# EAGLE design lightplay2a (EAGLE 7.2.0)
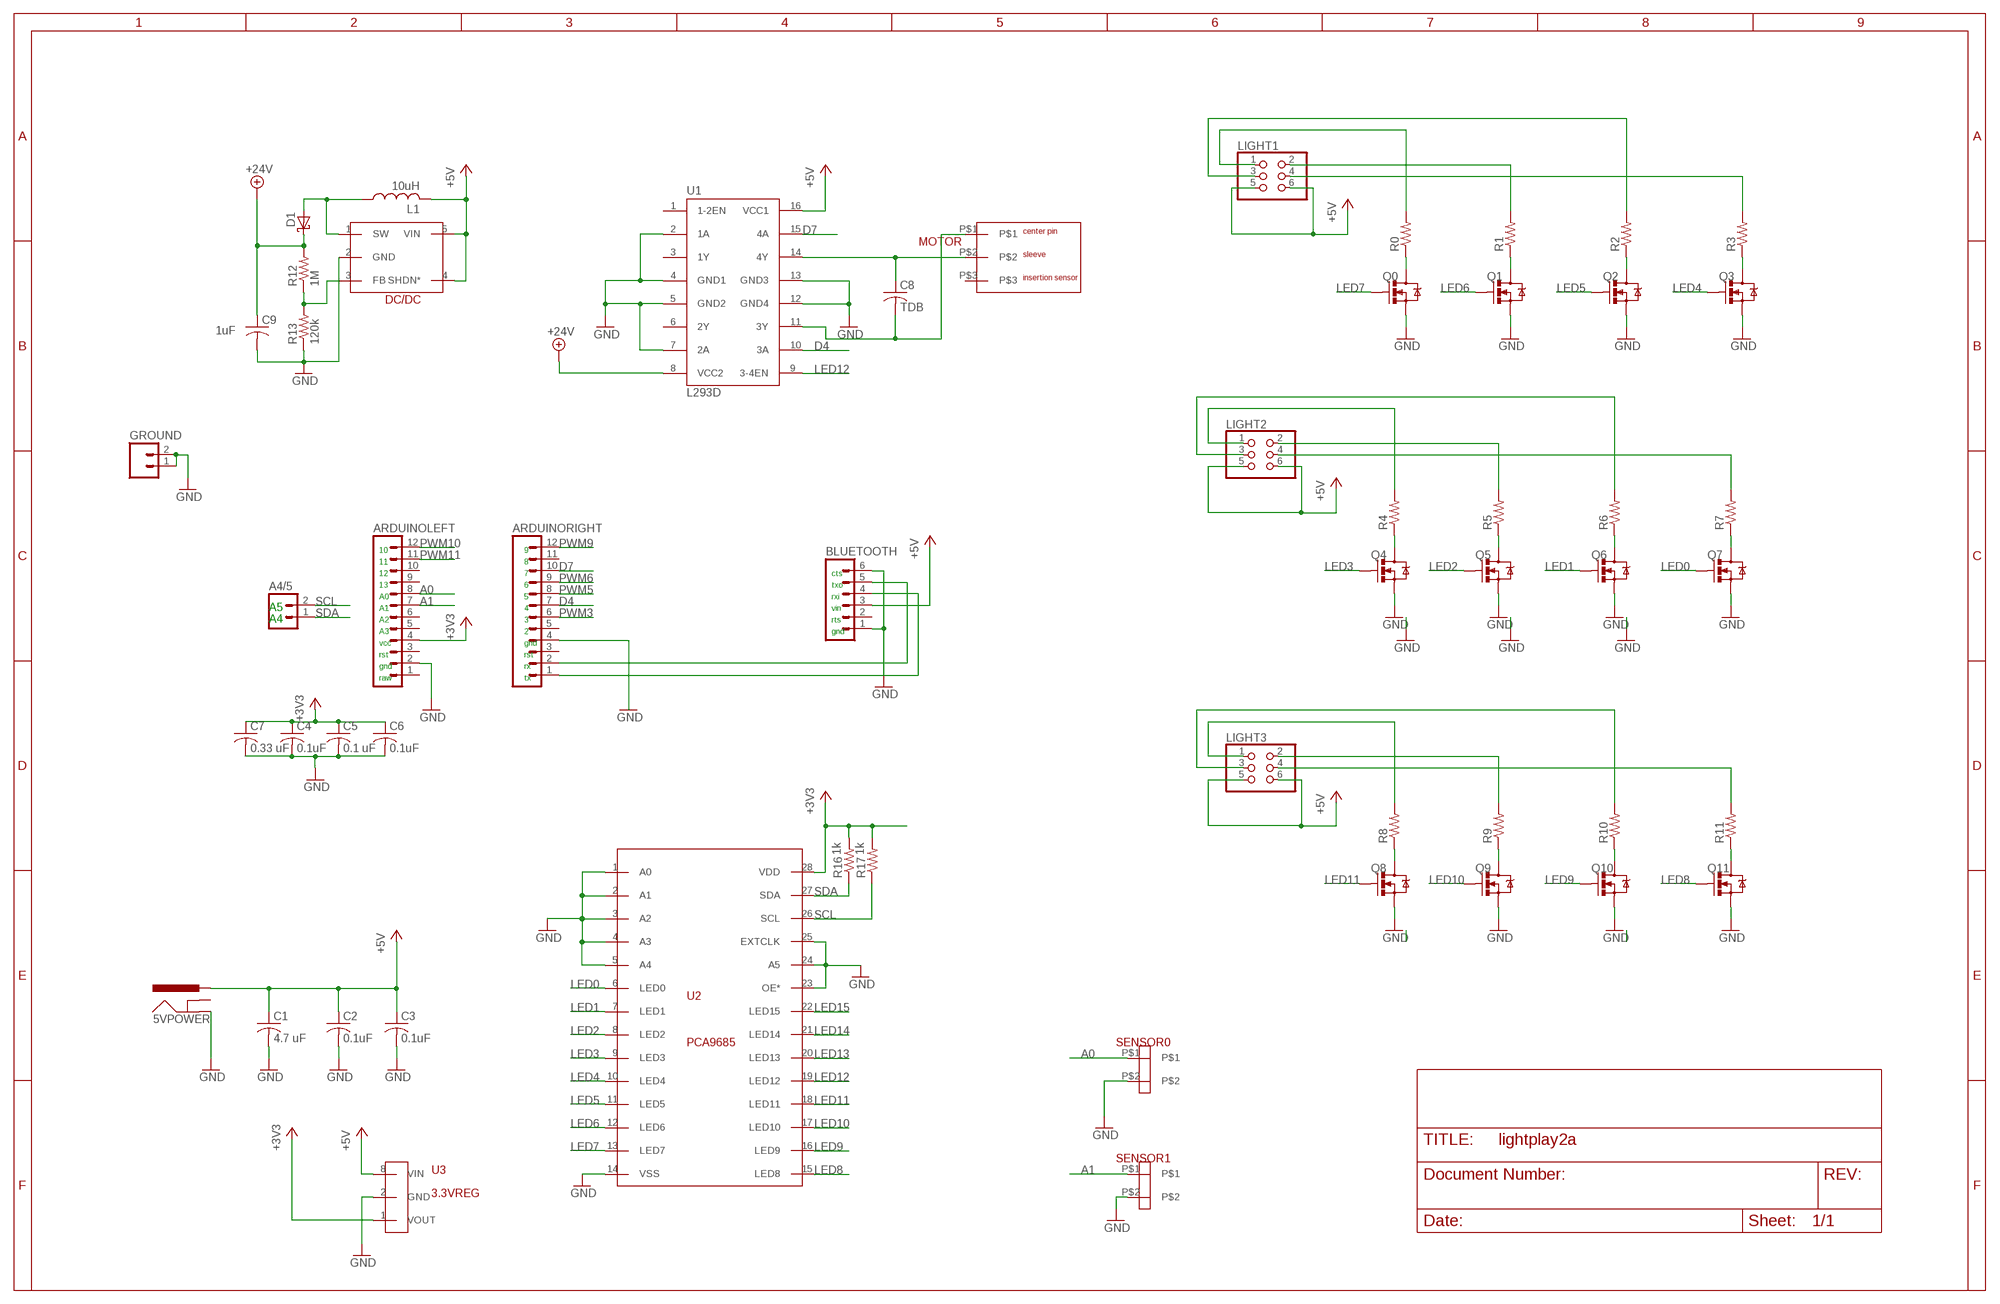
[diagram p0: schematic, sheet 1]

## Parts
5VPOWER  POWER_JACKPTH  [POWER_JACK_PTH]
A4/5  M02PTH  [1X02]
ARDUINOLEFT  M12PTH  [1X12]
ARDUINORIGHT  M12PTH  [1X12]
BLUETOOTH  M06SILK_FEMALE_PTH  [1X06]
C1  4.7 uF  C-USC1206  [C1206]
C2  0.1uF  C-USC0805  [C0805]
C3  0.1uF  C-USC0805  [C0805]
C4  0.1uF  C-USC0805  [C0805]
C5  0.1 uF  C-USC0805  [C0805]
C6  0.1uF  C-USC0805  [C0805]
C7  0.33 uF  C-USC1206  [C1206]
C8  TDB  C-USC0805  [C0805]
C9  1uF  C-USC1206  [C1206]
D1  B120_SHOTTKY_DIODE  [DO214AC]
DC/DC  LT1615  [SOT23-5]
GROUND  M02PTH  [1X02]
L1  10uH  INDUCTOR_WURTH  [INDUCTOR_WURTH]
LIGHT1  PINHD-2X3  [2X03]
LIGHT2  PINHD-2X3  [2X03]
LIGHT3  PINHD-2X3  [2X03]
MOTOR  PJ-075DH-SMT-TR  [PJ-075DH-SMT-TR]
Q0  MOSFET-NCHANNELAO3404A  [SOT23-3]
Q1  MOSFET-NCHANNELAO3404A  [SOT23-3]
Q2  MOSFET-NCHANNELAO3404A  [SOT23-3]
Q3  MOSFET-NCHANNELAO3404A  [SOT23-3]
Q4  MOSFET-NCHANNELAO3404A  [SOT23-3]
Q5  MOSFET-NCHANNELAO3404A  [SOT23-3]
Q6  MOSFET-NCHANNELAO3404A  [SOT23-3]
Q7  MOSFET-NCHANNELAO3404A  [SOT23-3]
Q8  MOSFET-NCHANNELAO3404A  [SOT23-3]
Q9  MOSFET-NCHANNELAO3404A  [SOT23-3]
Q10  MOSFET-NCHANNELAO3404A  [SOT23-3]
Q11  MOSFET-NCHANNELAO3404A  [SOT23-3]
R0  R-US_0617/17  [0617/17]
R1  R-US_0617/17  [0617/17]
R2  R-US_0617/17  [0617/17]
R3  R-US_0617/17  [0617/17]
R4  R-US_0617/17  [0617/17]
R5  R-US_0617/17  [0617/17]
R6  R-US_0617/17  [0617/17]
R7  R-US_0617/17  [0617/17]
R8  R-US_0617/17  [0617/17]
R9  R-US_0617/17  [0617/17]
R10  R-US_0617/17  [0617/17]
R11  R-US_0617/17  [0617/17]
R12  1M  R-US_R0805  [R0805]
R13  120k  R-US_R0805  [R0805]
R16  1k  R-US_R0805  [R0805]
R17  1k  R-US_R0805  [R0805]
SENSOR0  3.5MM_2PIN_SCREWTERMINAL_SPARKFUN  [1X02_3.5_SCREWTERM]
SENSOR1  3.5MM_2PIN_SCREWTERMINAL_SPARKFUN  [1X02_3.5_SCREWTERM]
U1  L293D  [DIL16]
U2  PCA9685  [TSSOP28]
U3  3.3VREG  STM3.3VREG  [SO08]

## Nets
+3V3: ARDUINOLEFT.4 C4.1 C5.1 C6.1 C7.1 R16.2 R17.2 U2.28(VDD) U3.1(VOUT)
+5V [power]: 5VPOWER.PWR BLUETOOTH.3 C1.1 C2.1 C3.1 DC/DC.4(SHDN*) DC/DC.5(VIN) L1.P$2 LIGHT1.5 LIGHT1.6 LIGHT2.5 LIGHT2.6 LIGHT3.5 LIGHT3.6 U1.16(VCC1) U3.8(VIN)
+24V [power]: C9.1 D1.C R12.2 U1.8(VCC2)
A0: ARDUINOLEFT.8 SENSOR0.P$1
A1: ARDUINOLEFT.7 SENSOR1.P$1
D4: ARDUINORIGHT.7 U1.10(3A)
D7: ARDUINORIGHT.10 U1.15(4A)
GND [power]: 5VPOWER.GND ARDUINOLEFT.2 ARDUINORIGHT.4 BLUETOOTH.1 BLUETOOTH.6 C1.2 C2.2 C3.2 C4.2 C5.2 C6.2 C7.2 C9.2 DC/DC.2(GND) GROUND.1 GROUND.2 Q0.2(S) Q1.2(S) Q2.2(S) Q3.2(S) Q4.2(S) Q5.2(S) Q6.2(S) Q7.2(S) Q8.2(S) Q9.2(S) Q10.2(S) Q11.2(S) R13.1 SENSOR0.P$2 SENSOR1.P$2 U1.2(1A) U1.4(GND1) U1.5(GND2) U1.7(2A) U1.12(GND4) U1.13(GND3) U2.1(A0) U2.2(A1) U2.3(A2) U2.4(A3) U2.5(A4) U2.14(VSS) U2.23(OE*) U2.24(A5) U2.25(EXTCLK) U3.2(GND)
LED0: Q7.1(G) U2.6(LED0)
LED1: Q6.1(G) U2.7(LED1)
LED2: Q5.1(G) U2.8(LED2)
LED3: Q4.1(G) U2.9(LED3)
LED4: Q3.1(G) U2.10(LED4)
LED5: Q2.1(G) U2.11(LED5)
LED6: Q1.1(G) U2.12(LED6)
LED7: Q0.1(G) U2.13(LED7)
LED8: Q11.1(G) U2.15(LED8)
LED9: Q10.1(G) U2.16(LED9)
LED10: Q9.1(G) U2.17(LED10)
LED11: Q8.1(G) U2.18(LED11)
LED12: U1.9(3-4EN) U2.19(LED12)
LED13: U2.20(LED13)
LED14: U2.21(LED14)
LED15: U2.22(LED15)
N$1 [power]: Q0.3(D) R0.1
N$2 [power]: Q1.3(D) R1.1
N$3 [power]: Q2.3(D) R2.1
N$4 [power]: C8.1 MOTOR.P$2 U1.14(4Y)
N$5 [power]: C8.2 MOTOR.P$1 U1.11(3Y)
N$7 [power]: D1.A DC/DC.1(SW) L1.P$1
N$8 [power]: LIGHT1.1 R0.2
N$9 [power]: Q3.3(D) R3.1
N$10 [power]: LIGHT1.2 R1.2
N$11: ARDUINORIGHT.2 BLUETOOTH.5
N$12: ARDUINORIGHT.1 BLUETOOTH.4
N$13 [power]: Q4.3(D) R4.1
N$14 [power]: LIGHT1.3 R2.2
N$15 [power]: LIGHT1.4 R3.2
N$16 [power]: Q5.3(D) R5.1
N$17 [power]: Q6.3(D) R6.1
N$18 [power]: Q7.3(D) R7.1
N$19 [power]: LIGHT2.1 R4.2
N$20 [power]: LIGHT2.2 R5.2
N$21 [power]: LIGHT2.3 R6.2
N$22 [power]: LIGHT2.4 R7.2
N$23 [power]: Q8.3(D) R8.1
N$24: Q9.3(D) R9.1
N$25 [power]: Q10.3(D) R10.1
N$26 [power]: Q11.3(D) R11.1
N$27 [power]: LIGHT3.1 R8.2
N$28: LIGHT3.2 R9.2
N$29 [power]: LIGHT3.3 R10.2
N$30 [power]: LIGHT3.4 R11.2
N$35 [power]: DC/DC.3(FB) R12.1 R13.2
PWM3: ARDUINORIGHT.6
PWM5: ARDUINORIGHT.8
PWM6: ARDUINORIGHT.9
PWM9: ARDUINORIGHT.12
PWM10: ARDUINOLEFT.12
PWM11: ARDUINOLEFT.11
SCL: A4/5.2 R17.1 U2.26(SCL)
SDA: A4/5.1 R16.1 U2.27(SDA)
Unconnected: 5VPOWER.GNDBREAK ARDUINOLEFT.1 ARDUINOLEFT.3 ARDUINOLEFT.5 ARDUINOLEFT.6 ARDUINOLEFT.9 ARDUINOLEFT.10 ARDUINORIGHT.3 ARDUINORIGHT.5 ARDUINORIGHT.11 BLUETOOTH.2 MOTOR.P$3 U1.1(1-2EN) U1.3(1Y) U1.6(2Y)

## Notes on the sheet
- 10 | 9
- 11 | 8
- 12 | 7 | cts
- 13 | 6 | txo
- A0 | 5 | rxi
- A5 | A1 | 4 | vin
- A4 | A2 | 3 | rts
- A3 | 2 | gnd
- vcc | gnd
- rst | rst
- gnd | rx
- raw | tx

## Library data of the parts
5VPOWER = SparkFun-Connectors:POWER_JACK: Power Jack This is the standard 5.5mm barrel jack for power. The PTH is the most common, proven, reliable, footprint. The Slot footprint only works if the mill layer is transmitted to the PCB fab house so be warned. Mating wall wart : TOL-00298 (and others); PROD_ID: CONN-08197
A4/5 GROUND = SparkFun-Connectors:M02: Standard 2-pin 0.1" header. Use with - straight break away headers ( PRT-00116) - right angle break away headers (PRT-00553) - swiss pins (PRT-00743) - machine pins (PRT-00117) - female headers (PRT-00115) Molex polarized connector foot print use with: PRT-08233 with associated crimp pins and housings. 2.54_SCREWTERM for use with PRT-10571. 3.5mm Screw Terminal footprints for PRT-08084 5mm Screw Terminal footprints for use with PRT-08432
ARDUINOLEFT ARDUINORIGHT = SparkFun-Connectors:M12: Header 12 Standard 12-pin 0.1" header. Use with straight break away headers (SKU : PRT-00116), right angle break away headers (PRT-00553), swiss pins (PRT-00743), machine pins (PRT-00117), and female headers (PRT-00115).
BLUETOOTH = SparkFun-Connectors:M06: Header 6 Standard 6-pin 0.1" header. Use with straight break away headers (SKU : PRT-00116), right angle break away headers (PRT-00553), swiss pins (PRT-00743), machine pins (PRT-00117), and female headers (PRT-00115). Molex polarized connector foot print use with SKU : PRT-08094 with associated crimp pins and housings. NOTES ON THE VARIANTS LOCK and LOCK_LONGPADS... This footprint was designed to help hold the alignment of a through-hole component (i.e. 6-pin header) while soldering it into place. You may notice that each hole has been shifted either up or down by 0.005 of an inch from it's more standard position (which is a perfectly straight line). This slight alteration caused the pins (the squares in the middle) to touch the edges of the holes. Because they are alternating, it causes a "brace" to hold the component in place. 0.005 has proven to be the perfect amount of "off-center" position when using our standard breakaway headers. Although looks a little odd when you look at the bare footprint, once you have a header in there, the alteration is very hard to notice. Also,if you push a header all the way into place, it is covered up entirely on the bottom side. This idea of altering the position of holes to aid alignment will be further integrated into the Sparkfun Library for other footprints. It can help hold any component with 3 or more connection pins.; PROD_ID: CONN-08437
C1-C9 = resistor:C-US: CAPACITOR, American symbol
D1 = robbie:B120_SHOTTKY_DIODE
DC/DC = robbie:LT1615
L1 = robbie:INDUCTOR_WURTH
LIGHT1-LIGHT3 = SparkFun-Connectors:PINHD-2X3: PIN HEADER
MOTOR = robbie:PJ-075DH-SMT-TR
Q0 Q1-Q11 = SparkFun-DiscreteSemi:MOSFET-NCHANNEL: Common NMOSFET Parts MFG P/N Store ID Prod ID FDD8780 TRANS-09984 SI7820DN TRANS-11055 FDS6630A IC-08089 2N7002PW TRANS-11151 FQP30N06L COM-10213 TRANS-10060 BSS123LT1G TRANS-08345 BSS138 TRANS-00830 BS170 2N7000; PROD_ID: TRAN-12988
R0 R1-R11 = robbie:R-US_: RESISTOR, American symbol
R12 R13 R16 R17 = resistor:R-US_: RESISTOR, American symbol
SENSOR0 SENSOR1 = robbie:3.5MM_2PIN_SCREWTERMINAL_SPARKFUN
U1 = st-microelectronics:L293D: PUSH-PULL 4 CHANNEL DRIVER; MPN: L293D; OC_FARNELL: 9589619; OC_NEWARK: 56P8249
U2 = robbie:PCA9685
U3 = robbie:STM3.3VREG

## Net classes
0 default: width 0.254 mm, clearance 0.203 mm
1 power: width 0.508 mm, clearance 0.254 mm

## Board
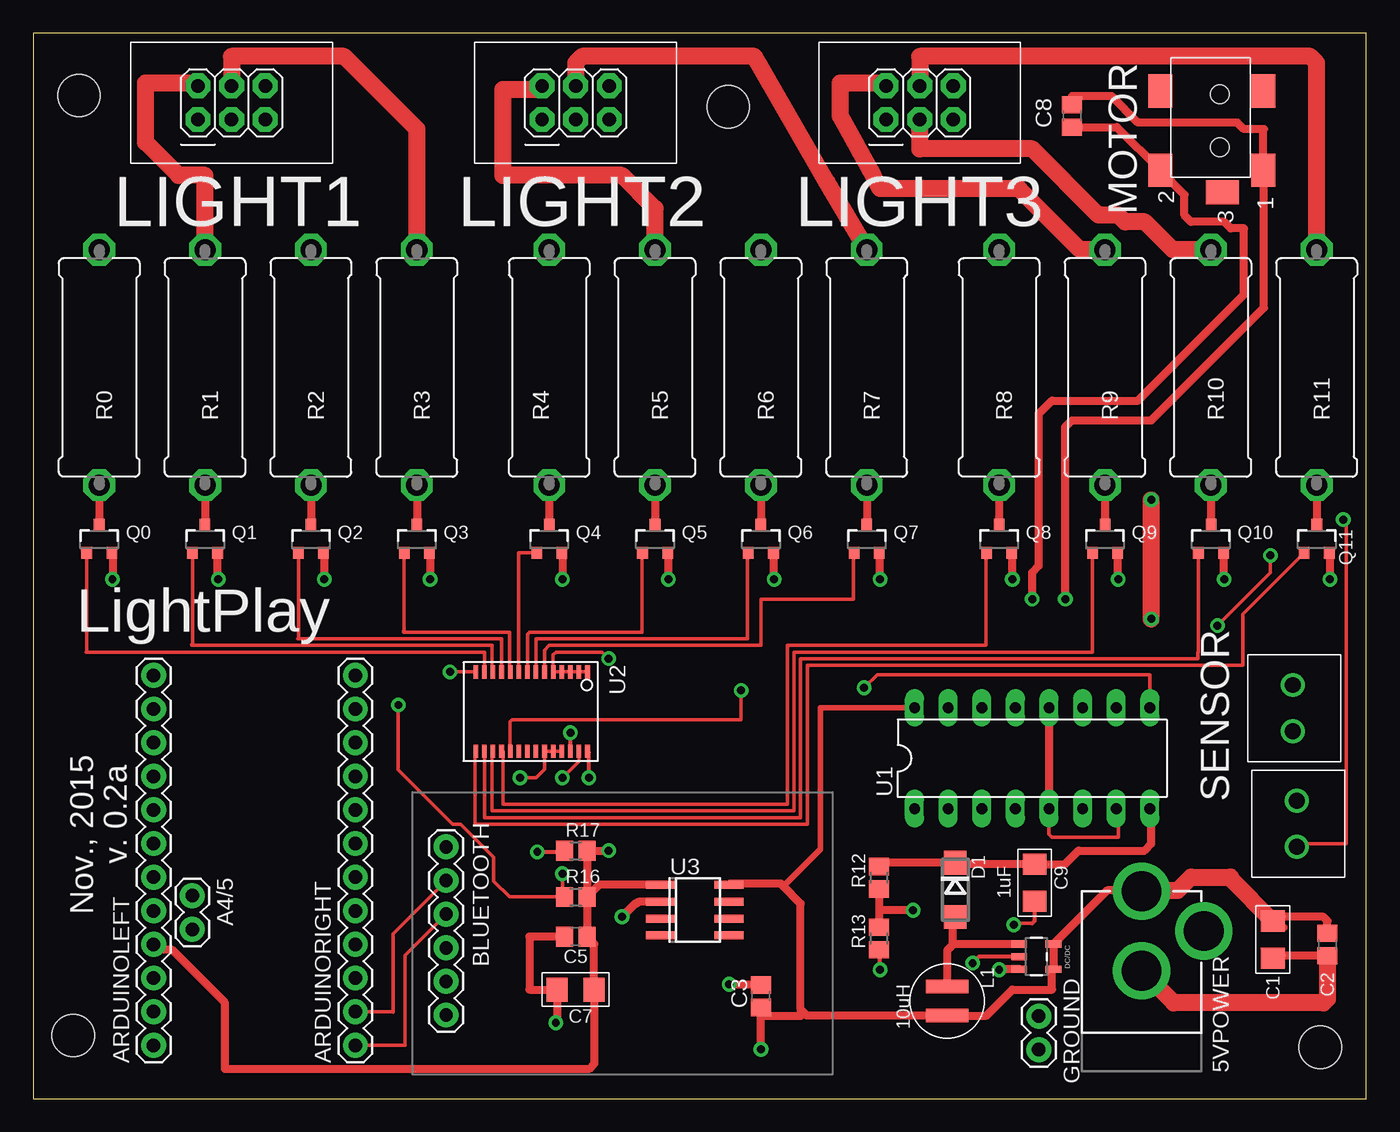
[diagram p1: board, top side]
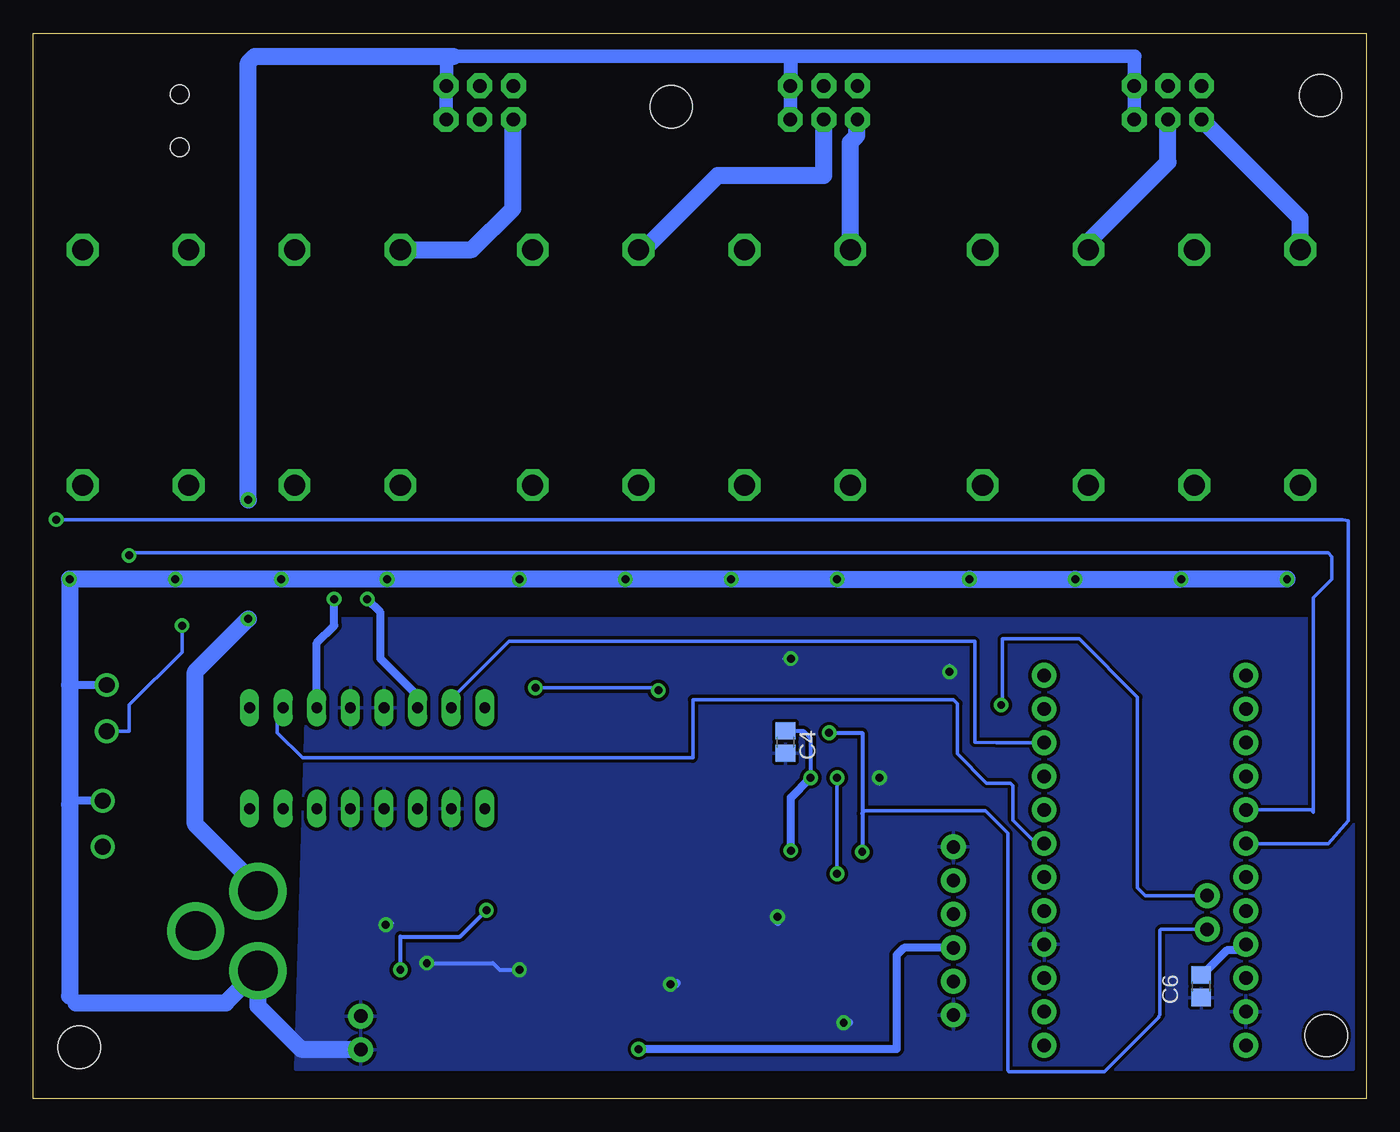
[diagram p2: board, bottom side, seen from below]

Size 100.75 x 80.51 mm. Coordinates in mm from the lower left corner, seen from the top.
Outline: 0,0 100.75,0 100.75,80.51 0,80.51 0,0
Copper layers (1*16): Top 0.035mm / dielectric 1.5mm / Bottom 0.035mm
Design rules "SparkFun": minimum track width 8mil, minimum drill 20mil, track to track 8mil, track to pad 8mil, pad to pad 8mil, via to via 8mil, smd to smd 8mil, copper to edge 8mil, drill to drill 8mil, minimum pad ring 12mil, minimum via ring 10mil, stop-mask expansion 4mil, vias tented up to drill 20mil, thermal gap 10mil
Holes 3.2 mm at 3.04,4.79 52.54,74.94 3.47,75.79 97.27,3.9

### Footprints (pad centres in the part's own frame; a part is rotated, then mirrored left to right if it is on the bottom)
POWER_JACK_PTH = drill 2.997 pad 4.318: GND 0,7.7; GNDBREAK 4.7,10.7; PWR 0,13.7
1X02 = drill 1.016 pad 1.88: 1 0,0; 2 2.54,0
1X12 = drill 1.016 pad 1.88: 1 0,0; 2 2.54,0; 3 5.08,0; 4 7.62,0; 5 10.16,0; 6 12.7,0; 7 15.24,0; 8 17.78,0; 9 20.32,0; 10 22.86,0; 11 25.4,0; 12 27.94,0
1X06 = drill 1.016 pad 1.88: 1 0,0; 2 2.54,0; 3 5.08,0; 4 7.62,0; 5 10.16,0; 6 12.7,0
C1206 = smd 1.6 x 1.8: 1 -1.4,0; 2 1.4,0
C0805 = smd 1.3 x 1.5: 1 -0.85,0; 2 0.85,0
DO214AC = smd 1.8 x 1.7: A 2.05,0; C -2.05,0
SOT23-5 = smd 0.55 x 1.2: 1 -0.95,-1.3; 2 0,-1.3; 3 0.95,-1.3; 4 0.95,1.3; 5 -0.95,1.3
INDUCTOR_WURTH = smd 1 x 3.2: P$1 -1.1,0; P$2 1.1,0
2X03 = drill 1.016 pad 1.88 octagon: 1 -2.54,-1.27; 2 -2.54,1.27; 3 0,-1.27; 4 0,1.27; 5 2.54,-1.27; 6 2.54,1.27
PJ-075DH-SMT-TR = smd 2.5 x 1.8: P$1 0,0; P$2 0,-7.8; P$4 -6,0; P$5 -6,-7.8 | smd 1.8 x 2.5: P$3 1.65,-3.1 | hole 1.4: -5.75,-3.3; -1.75,-3.3
SOT23-3 = smd 0.8 x 0.9: 1 -0.95,-1; 2 0.95,-1; 3 0,1.1
0617/17 = drill 1.6 octagon: 1 -8.89,0; 2 8.89,0
R0805 = smd 1.3 x 1.5: 1 -0.85,0; 2 0.85,0
1X02_3.5_SCREWTERM = drill 1.2: P$1 0,0; P$2 3.5,0
DIL16 = drill 0.813 long: 1 -8.89,-3.81; 2 -6.35,-3.81; 3 -3.81,-3.81; 4 -1.27,-3.81; 5 1.27,-3.81; 6 3.81,-3.81; 7 6.35,-3.81; 8 8.89,-3.81; 9 8.89,3.81; 10 6.35,3.81; 11 3.81,3.81; 12 1.27,3.81; 13 -1.27,3.81; 14 -3.81,3.81; 15 -6.35,3.81; 16 -8.89,3.81
TSSOP28 = smd 0.35 x 1: 1 -3.9,-3; 2 -3.25,-3; 3 -2.6,-3; 4 -1.95,-3; 5 -1.3,-3; 6 -0.65,-3; 7 0,-3; 8 0.65,-3; 9 1.3,-3; 10 1.95,-3; 11 2.6,-3; 12 3.25,-3; 13 3.9,-3; 14 4.55,-3; 15 4.55,3; 16 3.9,3; 17 3.25,3; 18 2.6,3; 19 1.95,3; 20 1.3,3; 21 0.65,3; 22 0,3; 23 -0.65,3; 24 -1.3,3; 25 -1.95,3; 26 -2.6,3; 27 -3.25,3; 28 -3.9,3
SO08 = smd 0.6 x 2.2: 1 -1.905,-2.6; 2 -0.635,-2.6; 3 0.635,-2.6; 4 1.905,-2.6; 5 1.905,2.6; 6 0.635,2.6; 7 -0.635,2.6; 8 -1.905,2.6

### Placement (x,y rotation side)
5VPOWER  83.77,1.98 0 top
A4/5  12.03,15.35 270 top
ARDUINOLEFT  9.11,4.05 90 top
ARDUINORIGHT  24.35,4.05 90 top
BLUETOOTH  31.21,6.33 90 top
C1  93.68,12.03 270 top
C2  97.8,11.65 270 top
C3  55,7.75 90 top
C4  43.9,26.95 270 bottom
C5  41,12.25 180 top
C6  12.49,8.51 270 bottom
C7  41,8.25 180 top
C8  78.5,74.25 90 top
C9  75.68,16.33 270 top
D1  69.66,15.78 270 top
DC/DC  75.81,10.74 270 top
GROUND  76,6.25 270 top
L1  69.08,7.39 270 top
LIGHT1  15,75.25 0 top
LIGHT2  41,75.25 0 top
LIGHT3  67,75.25 0 top
MOTOR  92.97,70.13 270 top
Q0  5,42.25 0 top
Q1  13,42.25 0 top
Q2  21,42.25 0 top
Q3  29,42.25 0 top
Q4  39,42.25 0 top
Q5  47,42.25 0 top
Q6  55,42.25 0 top
Q7  63,42.25 0 top
Q8  73,42.25 0 top
Q9  81,42.25 0 top
Q10  89,42.25 0 top
Q11  97,42.25 0 top
R0  5,55.25 90 top
R1  13,55.25 90 top
R2  21,55.25 90 top
R3  29,55.25 90 top
R4  39,55.25 90 top
R5  47,55.25 90 top
R6  55,55.25 90 top
R7  63,55.25 90 top
R8  73,55.25 90 top
R9  81,55.25 90 top
R10  89,55.25 90 top
R11  97,55.25 90 top
R12  63.93,16.7 90 top
R13  63.93,12.12 90 top
R16  41,15.25 0 top
R17  41,18.75 0 top
SENSOR0  95.2,27.76 90 top
SENSOR1  95.5,19.03 90 top
U1  75.5,25.73 0 top
U2  38,29.25 180 top
U3  50,14.25 270 top

### Tracks (layer width: path | path; a pad name or v marks a point on that pad's centre or on a via)
+3V3  (via drill 0.6)
  Top 0.305: v42,24.25 42,26.15 U2.28
  Top 0.61: U3.1 42.76,16.16 R16.2 | R16.2 R17.2 v43.5,18.75 | R16.2 C5.1 42.4,11.7 C7.1 42.4,2.65 42,2.25 14.5,2.25 14.5,7.25 10.5,11.25 9.53,11.25 ARDUINOLEFT.4
  Bottom 0.305: C4.1 42.55,27.8 42,27.25 v42,24.25
  Bottom 0.61: C6.1 12.4,9.36 10.5,11.25 9.53,11.25 ARDUINOLEFT.4 | v43.5,18.75 43.5,22.75 v42,24.25
+5V  (via drill 0.6)
  Top 0.406: U1.16 59.5,29.54 59.5,18.85 56.7,16.05
  Top 0.61: 94.5,12.93 C1.1 94,13.75 97.5,13.75 97.8,13.45 C2.1 | 5VPOWER.PWR 83.77,15.75 81.17,15.75 DC/DC.5 DC/DC.4 77,9.68 77,8.25 74,8.25 72.04,6.29 L1.P$2 58.46,6.29 58,6.75 | 58,6.75 58,14.75 56.7,16.05 56.5,16.25 52.7,16.25 U3.8 | 58,6.75 58,6.25 55,6.25 | 55,6.25 C3.1 | v55,3.75 55,6.25
  Top 1.27: v84.5,36.25 v84.5,45.25 | 83.77,15.75 86.5,15.75 87.5,16.75 90.5,16.75 90.5,16.61 C1.1
  Bottom 0.61: BLUETOOTH.3 34.94,11.41 35.5,10.85 35.5,3.75 v55,3.75
  Bottom 1.016: LIGHT1.5 LIGHT1.6 17.54,78.71 17.5,78.75 43.5,78.75 | LIGHT2.6 LIGHT2.5 | LIGHT3.5 LIGHT3.6 69.5,76.56 69.5,78.75 69,78.75 43.5,78.75 | 43.5,78.75 43.5,76.56 LIGHT2.6 | LIGHT2.6 43.54,78.71 43.5,78.75
  Bottom 1.27: 5VPOWER.PWR 83.77,16.02 88.5,20.75 88.5,32.25 v84.5,36.25 | v84.5,45.25 84.5,78.25 84,78.75 69,78.75
+24V
  Top 0.61: U1.8 84.5,21.81 84.5,19.25 84,18.75 79,18.75 77.98,17.73 C9.1 69.66,17.73 D1.C 64.21,17.83 R12.2
A0  (via drill 0.6)
  Top 0.254: v93.5,41.05 93.5,39.75 v89.5,35.75
  Bottom 0.254: ARDUINOLEFT.8 4.17,21.83 4,21.65 4,37.85 2.6,39.25 2.6,40.95 2.9,41.25 93.3,41.25 v93.5,41.05 | v89.5,35.75 89.5,33.75 93.5,29.75 93.5,27.75 SENSOR0.P$1
A1  (via drill 0.6)
  Top 0.254: v99,43.75 99.25,43.25 99.25,19.25 95.72,19.25 SENSOR1.P$1
  Bottom 0.254: ARDUINOLEFT.7 2.87,19.29 1.35,21.02 1.35,43.65 1.8,43.75 v99,43.75
D4
  Bottom 0.254: ARDUINORIGHT.7 24.93,19.29 26.7,21.05 26.7,23.65 26.9,23.85 28.7,23.85 30.9,26.05 30.9,29.85 31.2,30.15 50.9,30.15 50.9,25.75 80.4,25.75 82.3,27.65 82.3,29.09 U1.10
D7
  Bottom 0.254: ARDUINORIGHT.10 27.95,26.91 29.6,26.95 29.6,34.55 64.8,34.55 69.3,30.05 69.3,29.05 69.4,28.95 69.4,29.29 U1.15
GND  (via drill 0.6)
  Top 0.254: 75.5,13.25 74.2,13.25 v74.1,13.15 | U2.4 40,32.25 | U2.14 v31.5,32.25 | U2.25 U2.24 U2.23 38.65,24.9 38,24.25 v36.8,24.25 | U2.1 U2.2 U2.3 U2.4 | U2.4 U2.5 39.3,33.55 39.5,33.75 43,33.75 v43.5,33.25 | U1.5 76.77,19.98 77,19.75 82,19.75 82,21.77 U1.7
  Top 0.305: DC/DC.2 71.49,10.74 v71,10.25 | v64,9.75 64,11.2 R13.1 | C9.2 75.68,13.43 75.5,13.25
  Top 0.61: Q0.2 6,41.2 v6,39.25 | v14,39.25 13.95,39.3 Q1.2 | Q2.2 22,41.2 v22,39.25 | Q3.2 30,41.2 v30,39.25 | Q4.2 40,41.2 v40,39.25 | Q11.2 98,41.25 v98,39.25 | v48,39.25 48,41.2 Q5.2 | Q6.2 55.95,39.3 v56,39.25 | Q7.2 63.95,39.3 v64,39.25 | Q8.2 73.95,39.3 v74,39.25 | Q9.2 81.95,39.3 v82,39.25 | Q10.2 89.95,39.3 v90,39.25 | C2.2 93.68,10.8 C1.2 93.5,10.63 | C3.2 52.65,8.6 v52.6,8.65 | U3.2 45.73,14.89 45.6,14.75 45.5,14.75 v44.5,13.75 | C5.2 37.5,12.25 37.5,8.25 C7.2 39.6,5.85 v39.5,5.75 | U1.12 U1.5
  Top 1.27: C2.2 97.8,7.55 97.5,7.25 86.2,7.25 5VPOWER.GND
  Bottom 0.254: v36.8,24.25 36.8,23.75 | v74.1,13.15 73.7,13.15 73.6,13.25 | v31.5,32.25 31.5,32.75 | v43.5,33.25 44,33.25
  Bottom 0.305: v71,10.25 66,10.25 65.5,9.75 v64,9.75
  Bottom 0.508: 75.89,3.88 GROUND.2
  Bottom 0.61: v52.6,8.65 52.2,8.65 52.1,8.75 | v44.5,13.75 44.5,13.35 | v39.5,5.75 39.1,5.75 | SENSOR0.P$2 98,31.25 | 98,7.75 97.5,7.25 | SENSOR1.P$2 97.72,22.53 98,22.25
  Bottom 1.27: v6,39.25 v14,39.25 v22,39.25 v30,39.25 v40,39.25 v48,39.25 v56,39.25 v64,39.25 v74,39.25 v82,39.25 v90,39.25 v98,39.25 98,31.25 98,22.25 98,7.75 | GROUND.2 76.04,3.75 80.5,3.75 83.77,7.02 5VPOWER.GND 86.2,7.25 97.5,7.25
  pour Bottom (isolate 0.254): 1,36.25 1,2.25 80.9,2.25 79.9,36.25
LED0
  Top 0.254: U2.6 38.65,33.9 39,34.25 55,34.25 55,37.75 62,37.75 62,41.2 Q7.1
LED1
  Top 0.254: U2.7 38,34.75 54,34.75 54,41.2 Q6.1
LED2
  Top 0.254: U2.8 37.35,35.1 37.5,35.25 46,35.25 46,41.2 Q5.1
LED3
  Top 0.254: U2.9 36.7,41.25 Q4.1
LED4
  Top 0.254: U2.10 36,32.25 36,35.25 28,35.25 28,35.35 28.05,35.35 Q3.1
LED5
  Top 0.254: U2.11 35.4,34.75 20.05,34.75 | 20,34.75 20.05,34.75 | 20.05,34.75 Q2.1
LED6
  Top 0.254: U2.12 34.7,32.25 34.7,34.25 12,34.25 12,34.35 12.05,34.35 Q1.1
LED7
  Top 0.254: U2.13 34.1,33.75 4.05,33.75 | 4,33.75 4.05,33.75 | 4.05,33.75 Q0.1
LED8
  Top 0.254: 33.5,26.25 U2.15 33.4,26.25 33.4,20.75 58.5,20.75 58.5,32.75 91.4,32.75 91.4,36.6 Q11.1
LED9
  Top 0.254: U2.16 34.1,21.25 58,21.25 58,33.25 88,33.25 88,33.75 88.05,33.75 Q10.1
LED10
  Top 0.254: U2.17 34.7,26.25 34.7,21.75 57.5,21.75 57.5,33.75 80.05,33.75 Q9.1
LED11
  Top 0.254: U2.18 35.5,26.25 35.5,22.25 57,22.25 57,34.25 72,34.25 72,40.75 72.05,40.75 Q8.1
LED12  (via drill 0.6)
  Top 0.254: U2.19 36.05,28.5 36.2,28.65 53.5,28.65 v53.5,30.85 | U1.9 84.39,32.04 84.4,32.05 63.8,32.05 v62.8,31.05
  Bottom 0.254: v62.8,31.05 53.7,31.05 v53.5,30.85
N$1
  Top 0.61: R0.1 Q0.3
N$2
  Top 0.61: R1.1 Q1.3
N$3
  Top 0.61: R2.1 Q2.3
N$4  (via drill 0.6)
  Top 0.61: v75.5,37.75 75.5,39.75 76,40.25 76,51.75 77,52.75 83.5,52.75 91.5,60.75 91.5,65.75 90.5,65.75 90,66.25 87.5,66.25 87,66.75 87,68.3 MOTOR.P$2 81.9,73.4 C8.1
  Bottom 0.61: U1.14 71.69,30.44 74.5,33.25 74.5,36.75 v75.5,37.75
N$5  (via drill 0.6)
  Top 0.61: v78,37.75 78,50.75 78.5,51.25 84.5,51.25 93,59.75 93,70.1 MOTOR.P$1 92.97,73.22 93,73.25 91.5,73.25 91,73.75 83.5,73.75 81.5,75.75 78.5,75.75 C8.2
  Bottom 0.61: U1.11 79.31,34.44 78,35.75 v78,37.75
N$7
  Top 0.61: DC/DC.1 69.56,11.69 | 69.56,11.69 69.5,11.75 69.5,13.57 D1.A | L1.P$1 69.08,11.21 69.56,11.69
N$8
  Bottom 1.27: R0.2 5,66.52 LIGHT1.1
N$9
  Top 0.61: R3.1 Q3.3
N$10
  Top 1.27: R1.2 13,69.75 11,69.75 8.5,72.25 8.5,76.75 12.23,76.75 LIGHT1.2
N$11
  Top 0.254: ARDUINORIGHT.2 27.17,6.59 27.2,6.55 27.2,12.48 BLUETOOTH.5
N$12
  Top 0.254: ARDUINORIGHT.1 28.09,4.05 28.1,4.05 28.1,10.84 BLUETOOTH.4
N$13
  Top 0.61: R4.1 Q4.3
N$14
  Bottom 1.27: R2.2 21,64.75 15,70.75 LIGHT1.3
N$15
  Top 1.27: R3.2 29,73.25 23.5,78.75 15,78.75 LIGHT1.4
N$16
  Top 0.61: R5.1 Q5.3
N$17
  Top 0.61: R6.1 Q6.3
N$18
  Top 0.61: R7.1 Q7.3
N$19
  Bottom 1.27: R4.2 39,72.25 38.5,72.75 38.5,73.94 LIGHT2.1
N$20
  Top 1.27: R5.2 47,67.25 44.5,69.75 35.5,69.75 35.5,76.25 38.19,76.25 LIGHT2.2
N$21
  Bottom 1.27: R6.2 54.61,64.14 49,69.75 41,69.75 LIGHT2.3
N$22
  Top 1.27: R7.2 60,69.25 54.5,78.75 41.5,78.75 41,78.25 LIGHT2.4
N$23
  Top 0.61: R8.1 Q8.3
N$24
  Top 0.61: R9.1 Q9.3
N$25
  Top 0.61: R10.1 Q10.3
N$26
  Top 0.61: R11.1 Q11.3
N$27
  Bottom 1.27: R8.2 67.61,64.14 64.5,67.25 64.5,73.94 LIGHT3.1
N$28
  Top 1.27: R9.2 79.11,64.14 74.5,68.75 64,68.75 63.5,69.75 61,74.25 61,76.75 64.23,76.75 LIGHT3.2
N$29
  Top 1.27: R10.2 86.11,64.14 84,66.25 82.5,66.25 82,66.75 80.5,66.75 75.5,71.75 67,71.75 LIGHT3.3
N$30
  Top 1.27: R11.2 97,78.25 96.5,78.75 67,78.75 LIGHT3.4
N$35  (via drill 0.6)
  Top 0.61: R12.1 63.93,14.25 | 63.93,14.25 R13.2 | DC/DC.3 73.04,9.79 v73,9.75 | v66.5,14.25 63.93,14.25
  Bottom 0.305: v73,9.75 73,12.25 68.5,12.25 v66.5,14.25
SCL  (via drill 0.6)
  Top 0.305: U2.26 v40.6,27.65 | v38.1,18.65 40.15,18.65 R17.1
  Bottom 0.254: A4/5.2 15.54,12.81 15.6,12.75 15.6,6.35 15.7,6.25 15.7,6.15 19.8,2.05 27,2.05 27.1,2.15 27.1,20.05 28.8,21.75 37.9,21.75 38.1,21.55
  Bottom 0.305: v40.6,27.65 38.1,27.65 38.1,21.55 v38.1,18.65
SDA  (via drill 0.6)
  Top 0.254: U2.27 41.25,25.5 v40,24.25 | v40,17 40,15.4 R16.1 36,15.25 34.8,16.45 34.8,18.25 32.3,20.75 31.7,20.75 27.6,24.85 v27.6,29.75
  Bottom 0.254: v40,24.25 v40,17 | A4/5.1 16.7,15.35 17.3,15.95 17.3,30.35 21.7,34.75 27.5,34.75 27.5,29.85 v27.6,29.75

### Text on the board
tPlace: LightPlay | SENSOR | v. 0.2a | Nov., 2015